# EAGLE schematic cape-eeprom (EAGLE 6.5.0)
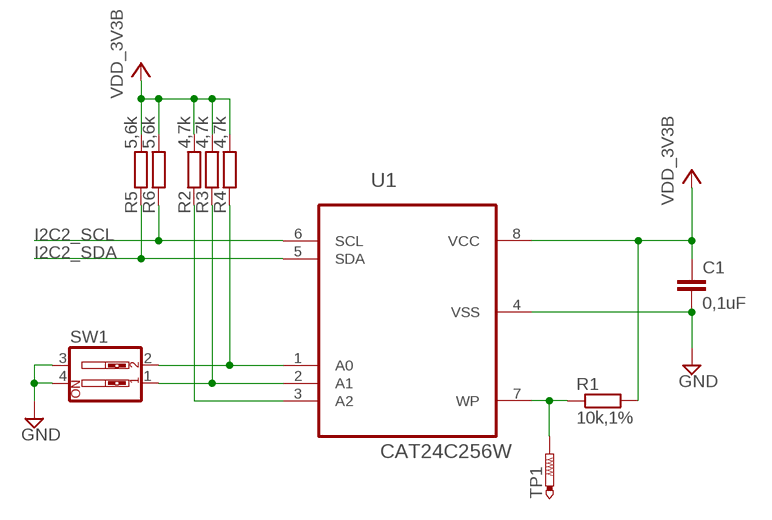
[diagram p0: schematic, sheet 1]

## Parts
C1  0,1uF  C2,5-3  [C2.5-3]
R1  10k,1%  R-EU_M0805  [M0805]
R2  4,7k  R-EU_M1206  [M1206]
R3  4,7k  R-EU_M1206  [M1206]
R4  4,7k  R-EU_M1206  [M1206]
R5  5,6k  R-EU_M1206  [M1206]
R6  5,6k  R-EU_M1206  [M1206]
SW1  SW_DIP-2  [EDG-02]
TP1  PTR1B1,27  [B1,27]
U1  CAT24C256W  [SOIC127P600X175-8N]

## Nets
+3V3: C1.1 R1.2 R2.2 R3.2 R4.2 R5.2 R6.2 U1.8(VCC) ; supply symbol labelled VDD_3V3B
GND: C1.2 SW1.3 SW1.4 U1.4(VSS)
I2C2_SCL: R6.1 U1.6(SCL)
I2C2_SDA: R5.1 U1.5(SDA)
N$1: R1.1 TP1.TP U1.7(WP)
N$2: R4.1 SW1.2 U1.1(A0)
N$3: R3.1 SW1.1 U1.2(A1)
N$4: R2.1 U1.3(A2)

## Library data of the parts
C1 = capacitor-wima:C: CAPACITOR naming: grid - package width
R1 = resistor:R-EU_: RESISTOR, European symbol
R2-R6 = brewbox-components:R-EU_: RESISTOR, European symbol
SW1 = special:SW_DIP-2: DIP SWITCH
TP1 = testpad:PTR1: TEST PIN
U1 = brewbox-components:CAT24C256W: 256-Kb I2C CMOS Serial EEPROM; MPN: CAT24C256WI-G; OC_FARNELL: 1631142; OC_NEWARK: 06R0552; PACKAGE: SOIC-8; SUPPLIER: CATALYST SEMICONDUCTOR